# EAGLE schematic TinyNES_Main_Board (EAGLE 9.6.2)
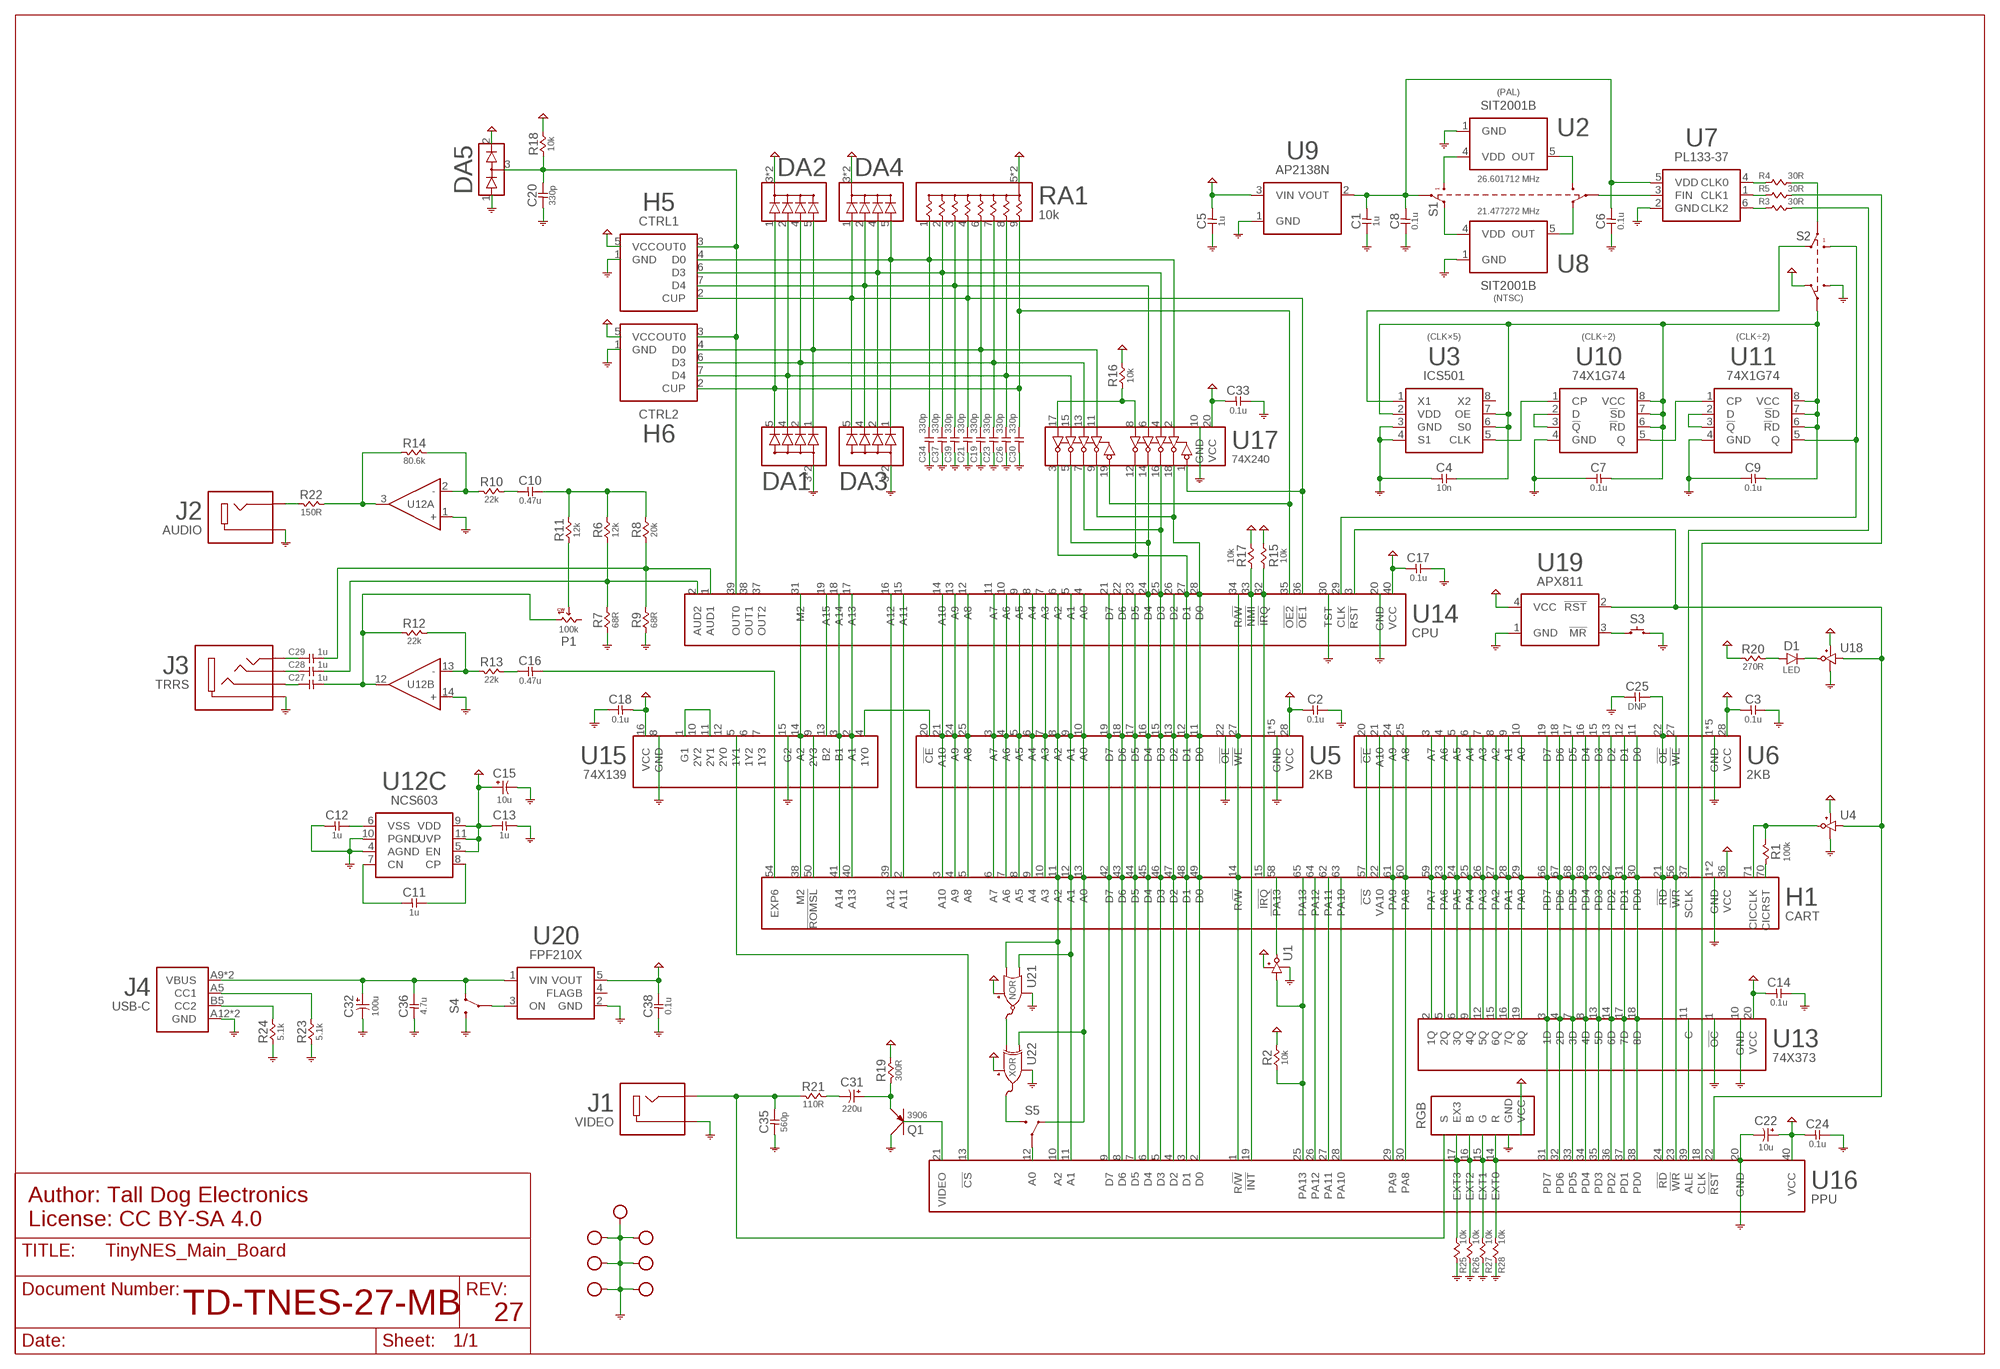
[diagram p0: schematic, sheet 1]

## Parts
C1  1u  CAP-NP-0805  [0805-NP]
C2  0.1u  CAP-NP-0805  [0805-NP]
C3  0.1u  CAP-NP-0805  [0805-NP]
C4  10n  CAP-NP-0805  [0805-NP]
C5  1u  CAP-NP-0805  [0805-NP]
C6  0.1u  CAP-NP-0805  [0805-NP]
C7  0.1u  CAP-NP-0805  [0805-NP]
C8  0.1u  CAP-NP-0805  [0805-NP]
C9  0.1u  CAP-NP-0805  [0805-NP]
C10  0.47u  CAP-NP-1206  [1206-NP]
C11  1u  CAP-NP-0805  [0805-NP]
C12  1u  CAP-NP-0805  [0805-NP]
C13  1u  CAP-NP-0805  [0805-NP]
C14  0.1u  CAP-NP-0805  [0805-NP]
C15  10u  CAP-P-B  [ECAP-B]
C16  0.47u  CAP-NP-1206  [1206-NP]
C17  0.1u  CAP-NP-0805  [0805-NP]
C18  0.1u  CAP-NP-0805  [0805-NP]
C19  330p  CAP-NP-0805  [0805-NP]
C20  330p  CAP-NP-0805  [0805-NP]
C21  330p  CAP-NP-0805  [0805-NP]
C22  10u  CAP-P-1206  [1206-P]
C23  330p  CAP-NP-0805  [0805-NP]
C24  0.1u  CAP-NP-0805  [0805-NP]
C25  DNP  CAP-NP-0805  [0805-NP]
C26  330p  CAP-NP-0805  [0805-NP]
C27  1u  CAP-NP-1210  [1210-NP]
C28  1u  CAP-NP-1210  [1210-NP]
C29  1u  CAP-NP-1210  [1210-NP]
C30  330p  CAP-NP-0805  [0805-NP]
C31  220u  CAP-P-E  [ECAP-E]
C32  100u  CAP-P-D  [ECAP-D]
C33  0.1u  CAP-NP-0805  [0805-NP]
C34  330p  CAP-NP-0805  [0805-NP]
C35  560p  CAP-NP-0805  [0805-NP]
C36  4.7u  CAP-NP-0805  [0805-NP]
C37  330p  CAP-NP-0805  [0805-NP]
C38  0.1u  CAP-NP-0805  [0805-NP]
C39  330p  CAP-NP-0805  [0805-NP]
D1  LED  DIODE-LED-5MM  [LED-5MM]
DA1  DA4-CA-SOT-363  [SOT-363-NP]
DA2  DA4-CK-SOT-363  [SOT-363-NP]
DA3  DA4-CA-SOT-363  [SOT-363-NP]
DA4  DA4-CK-SOT-363  [SOT-363-NP]
DA5  DA2-S  [SOT-23-3]
H1  CART  CART-72-CONN-VERT  [CART-72-2.50-CONN-VERT]
H5  CTRL1  CTRL  [JST-PH-7]
H6  CTRL2  CTRL  [JST-PH-7]
HOLE1  HOLE-M2.5  [HOLE-M2.5]
HOLE2  HOLE-M2.5  [HOLE-M2.5]
HOLE3  HOLE-M2.5  [HOLE-M2.5]
HOLE4  HOLE-M2.5  [HOLE-M2.5]
HOLE5  HOLE-M2.5  [HOLE-M2.5]
HOLE6  HOLE-M2.5  [HOLE-M2.5]
HOLE7  HOLE-M2.5  [HOLE-M2.5]
J1  VIDEO  JACK  [RCJ]
J2  AUDIO  JACK  [RCJ]
J3  TRRS  TRRS-SJ-43514  [SJ-43514]
J4  USB-C  USB-C-POWER  [USB4125]
P1  100k  POT  [POT-3361]
Q1  3906  PNP  [SOT-23-3]
R1  100k  RESISTOR-0805  [0805-NP]
R2  10k  RESISTOR-0805  [0805-NP]
R3  30R  RESISTOR-0805  [0805-NP]
R4  30R  RESISTOR-0805  [0805-NP]
R5  30R  RESISTOR-0805  [0805-NP]
R6  12k  RESISTOR-0805  [0805-NP]
R7  68R  RESISTOR-0805  [0805-NP]
R8  20k  RESISTOR-0805  [0805-NP]
R9  68R  RESISTOR-0805  [0805-NP]
R10  22k  RESISTOR-0805  [0805-NP]
R11  12k  RESISTOR-0805  [0805-NP]
R12  22k  RESISTOR-0805  [0805-NP]
R13  22k  RESISTOR-0805  [0805-NP]
R14  80.6k  RESISTOR-0805  [0805-NP]
R15  10k  RESISTOR-0805  [0805-NP]
R16  10k  RESISTOR-0805  [0805-NP]
R17  10k  RESISTOR-0805  [0805-NP]
R18  10k  RESISTOR-0805  [0805-NP]
R19  300R  RESISTOR-0805  [0805-NP]
R20  270R  RESISTOR-0805  [0805-NP]
R21  110R  RESISTOR-0805  [0805-NP]
R22  150R  RESISTOR-0805  [0805-NP]
R23  5.1k  RESISTOR-0805  [0805-NP]
R24  5.1k  RESISTOR-0805  [0805-NP]
R25  10k  RESISTOR-0603  [0603-NP]
R26  10k  RESISTOR-0603  [0603-NP]
R27  10k  RESISTOR-0603  [0603-NP]
R28  10k  RESISTOR-0603  [0603-NP]
RA1  10k  RA8  [EXBA10P]
RGB  RGB-TOP  [RGB-TOP]
S1  DPDT-LONG  [JS202011J]
S2  DPDT  [JS202011J]
S3  SWITCH  [TL1105]
S4  SPDT-EG1213  [EG1213]
S5  SPDT-CUS-12TB  [CUS-12TB]
U1  BUFFER  [SOT-23-5]
U2  SIT2001B  [SOT-23-5]
U3  ICS501  [SOIC-8]
U4  BUFFER  [SOT-23-5]
U5  2KB  [SOIC-28]
U6  2KB  [SOIC-28]
U7  PL133-37  [SOT-23-6]
U8  SIT2001B  [SOT-23-5]
U9  AP2138N  [SOT-23-3]
U10  74X1G74  [TSSOP-8]
U11  74X1G74  [TSSOP-8]
U12  NCS603  [TSSOP-14]
U13  74X373  [SOIC-20]
U14  CPU  [DIP-40]
U15  74X139  [SOIC-16]
U16  PPU  [DIP-40]
U17  74X240  [SOIC-20]
U18  BUFFER  [SOT-23-5]
U19  APX811  [SOT-143]
U20  FPF210X  [SOT-23-5]
U21  NOR  [SOT-23-5]
U22  XOR  [SOT-23-5]

## Nets
1Y0-!CS: U5.20(!CE) U15.4(1Y0)
3V3: C1.1 C6.1 C8.1 S1.BCOM U7.5(VDD) U9.2(VOUT)
!IRQ: H1.15(!IRQ) R15.1 U14.32(!IRQ)
!NMI: R17.1 U14.33(!NMI) U16.19(!INT)
!OE1: C21.2 DA3.5 DA4.1 H5.2(CUP) RA1.4 U14.36(!OE1) U17.1(1!OE)
!OE2: C30.2 DA1.5 DA2.1 H6.2(CUP) RA1.9 U14.35(!OE2) U17.19(2!OE)
!PA13: H1.58(!PA13) U1.4(Y)
!ROMSEL: H1.50(!ROMSL) U15.9(2Y3)
A0: H1.13(A0) S5.1 U5.10(A0) U14.4(A0) U22.1(B)
A0-NOR: U21.4(Y) U22.2(A)
A0-PPU: S5.2 U16.12(A0)
A0-XOR: S5.3 U22.4(Y)
A1: H1.12(A1) U5.9(A1) U14.5(A1) U16.11(A1) U21.1(B)
A2: H1.11(A2) U5.8(A2) U14.6(A2) U16.10(A2) U21.2(A)
A3: H1.10(A3) U5.7(A3) U14.7(A3)
A4: H1.9(A4) U5.6(A4) U14.8(A4)
A5: H1.8(A5) U5.5(A5) U14.9(A5)
A6: H1.7(A6) U5.4(A6) U14.10(A6)
A7: H1.6(A7) U5.3(A7) U14.11(A7)
A8: H1.5(A8) U5.25(A8) U14.12(A8)
A9: H1.4(A9) U5.24(A9) U14.13(A9)
A10: H1.3(A10) U5.21(A10) U14.14(A10)
A11: H1.2(A11) U14.15(A11)
A12: H1.39(A12) U14.16(A12)
A13: H1.40(A13) U14.17(A13) U15.2(A1)
A14: H1.41(A14) U14.18(A14) U15.3(B1)
A15: U14.19(A15) U15.13(B2)
ALE: U13.11(C) U16.39(ALE)
AUDIO1-AC: C29.2 J3.2(T)
AUDIO1-DC: C29.1 R8.1 R9.2 U14.1(AUD1)
AUDIO2-AC: C28.2 J3.3(RT)
AUDIO2-DC: C28.1 R6.1 R7.2 U14.2(AUD2)
AUDIO-MIX: C10.2 R6.2 R8.2 R11.2
AUDIO-MIX-1: C10.1 R10.1
AUDIO-MIX-2: R10.2 R14.1 U12.2(A:-)
AUDIO-MIX-AC: J2.2B(T) J2.2T(T) R22.2
AUDIO-MIX-DC: R14.2 R22.1 U12.3(A:OUT)
CARTCLK: H1.37(SCLK) R3.1
CC1: J4.A5(CC1) R23.2
CC2: J4.B5(CC2) R24.2
CIC: H1.71(CICCLK) R1.2 U4.4(Y)
CICRST: H1.70(CICRST) R1.1
CLK0: R4.2 U7.4(CLK0)
CLK1: R5.2 U7.1(CLK1)
CLK2: R3.2 U7.6(CLK2)
CLK5X: U3.5(CLK) U10.1(CP)
CLK5X/2: U10.5(Q) U11.1(CP)
CLK-FIN: S1.ACOM U7.3(FIN)
CLK-NTSC: S1.AB U8.5(OUT)
CLK-PAL: S1.AA U2.5(OUT)
CLKIN: S2.BB U3.1(X1)
CLKVCC: C4.2 C7.1 C9.1 S2.ACOM U3.2(VDD) U3.6(S0) U3.7(OE) U10.6(!R!D) U10.7(!S!D) U10.8(VCC) U11.6(!R!D) U11.7(!S!D) U11.8(VCC)
CN: C11.1 U12.7(C:CN)
CP: C11.2 U12.8(C:CP)
CPUCLK: S2.BA U11.5(Q) U14.29(CLK)
CPUCLK-SW: R4.1 S2.BCOM
D0: H1.49(D0) U5.11(D0) U14.28(D0) U16.2(D0) U17.9(2Y1) U17.18(1Y1)
D1: H1.48(D1) U5.12(D1) U14.27(D1) U16.3(D1) U17.3(2Y4) U17.12(1Y4)
D1-PULLUP: R16.1 U17.8(1A4) U17.17(2A4)
D2: H1.47(D2) U5.13(D2) U14.26(D2) U16.4(D2)
D3: H1.46(D3) U5.15(D3) U14.25(D3) U16.5(D3) U17.7(2Y2) U17.16(1Y2)
D4: H1.45(D4) U5.16(D4) U14.24(D4) U16.6(D4) U17.5(2Y3) U17.14(1Y3)
D5: H1.44(D5) U5.17(D5) U14.23(D5) U16.7(D5)
D6: H1.43(D6) U5.18(D6) U14.22(D6) U16.8(D6)
D7: H1.42(D7) U5.19(D7) U14.21(D7) U16.9(D7)
DQ1: U10.2(D) U10.3(!Q)
DQ2: U11.2(D) U11.3(!Q)
EXP6: C16.1 H1.54(EXP6)
EXP6-1: C16.2 R13.1
EXP6-2: R12.1 R13.2 U12.13(B:-)
EXP6-AC: C27.2 J3.4(RS)
EXP6-DC: C27.1 P1.3(CW) R12.2 U12.12(B:OUT)
EXP6-MIX: P1.2(WIPER) R11.1
EXT3: R25.2 RGB.EXT3(EX3) U16.17(EXT3)
G1-2Y1: U15.1(G1) U15.11(2Y1)
GND: C1.2 C2.2 C3.2 C4.1 C5.2 C6.2 C7.2 C8.2 C9.2 C12.1 C13.1 C14.2 C15.C C17.2 C18.2 C19.1 C20.1 C21.1 C22.N(C) C23.1 C24.2 C25.1 C26.1 C30.1 C32.C C33.2 C34.1 C35.1 C36.1 C37.1 C38.1 C39.1 DA1.3(COM) DA1.6(COM) DA3.3(COM) DA3.6(COM) DA5.1(A) H1.1(GND) H1.72(GND) H5.1(GND) H6.1(GND) HOLE1.P$1 HOLE1.P$6 HOLE1.P$7 HOLE1.P$8 HOLE1.P$9 HOLE1.P$13 HOLE1.P$14 HOLE1.P$15 HOLE1.P$16 HOLE2.P$1 HOLE2.P$6 HOLE2.P$7 HOLE2.P$8 HOLE2.P$9 HOLE2.P$13 HOLE2.P$14 HOLE2.P$15 HOLE2.P$16 HOLE3.P$1 HOLE3.P$6 HOLE3.P$7 HOLE3.P$8 HOLE3.P$9 HOLE3.P$13 HOLE3.P$14 HOLE3.P$15 HOLE3.P$16 HOLE4.P$1 HOLE4.P$6 HOLE4.P$7 HOLE4.P$8 HOLE4.P$9 HOLE4.P$13 HOLE4.P$14 HOLE4.P$15 HOLE4.P$16 HOLE5.P$1 HOLE5.P$6 HOLE5.P$7 HOLE5.P$8 HOLE5.P$9 HOLE5.P$13 HOLE5.P$14 HOLE5.P$15 HOLE5.P$16 HOLE6.P$1 HOLE6.P$6 HOLE6.P$7 HOLE6.P$8 HOLE6.P$9 HOLE6.P$13 HOLE6.P$14 HOLE6.P$15 HOLE6.P$16 HOLE7.P$1 HOLE7.P$6 HOLE7.P$7 HOLE7.P$8 HOLE7.P$9 HOLE7.P$13 HOLE7.P$14 HOLE7.P$15 HOLE7.P$16 J1.1B(S) J1.1T(S) J2.1B(S) J2.1T(S) J3.1(S) J4.A12(GND) J4.B12(GND) Q1.3(C) R7.1 R9.1 R23.1 R24.1 R25.1 R26.1 R27.1 R28.1 RGB.GND S2.AA S3.2 S4.3 U1.1(GND) U1.3(GND) U2.1(GND) U3.3(GND) U3.4(S1) U4.1(GND) U4.3(GND) U5.1(GND) U5.2(GND) U5.14(GND) U5.22(!OE) U5.23(GND) U5.26(GND) U6.1(GND) U6.2(GND) U6.14(GND) U6.23(GND) U6.26(GND) U7.2(GND) U8.1(GND) U9.1(GND) U10.4(GND) U11.4(GND) U12.1(A:+) U12.4(C:AGND) U12.10(C:PGND) U12.14(B:+) U13.1(!OC) U13.10(GND) U14.20(GND) U14.30(TST) U15.8(GND) U15.15(G2) U16.20(GND) U17.10(GND) U18.1(GND) U18.3(GND) U19.1(GND) U20.2(GND) U21.3(GND) U22.3(GND)
GND-CAP: C12.2 U12.6(C:VSS)
LEDA: D1.A R20.1
LEDK: D1.K(C) U18.4(Y)
M2: H1.38(M2) U14.31(M2) U15.14(A2)
OUT0: C20.2 DA5.3(COM) H5.3(OUT0) H6.3(OUT0) R18.1 U14.39(OUT0)
P1-D0: C34.2 DA3.1 DA4.5 H5.4(D0) RA1.1 U17.2(1A1)
P1-D3: C37.2 DA3.2 DA4.4 H5.6(D3) RA1.2 U17.4(1A2)
P1-D4: C39.2 DA3.4 DA4.2 H5.7(D4) RA1.3 U17.6(1A3)
P2-D0: C19.2 DA1.1 DA2.5 H6.4(D0) RA1.6 U17.11(2A1)
P2-D3: C23.2 DA1.2 DA2.4 H6.6(D3) RA1.7 U17.13(2A2)
P2-D4: C26.2 DA1.4 DA2.2 H6.7(D4) RA1.8 U17.15(2A3)
PA0: H1.29(PA0) U6.10(A0) U13.19(8Q)
PA1: H1.28(PA1) U6.9(A1) U13.16(7Q)
PA2: H1.27(PA2) U6.8(A2) U13.15(6Q)
PA3: H1.26(PA3) U6.7(A3) U13.12(5Q)
PA4: H1.25(PA4) U6.6(A4) U13.9(4Q)
PA5: H1.24(PA5) U6.5(A5) U13.6(3Q)
PA6: H1.23(PA6) U6.4(A6) U13.5(2Q)
PA7: H1.59(PA7) U6.3(A7) U13.2(1Q)
PA8: H1.60(PA8) U6.25(A8) U16.30(PA8)
PA9: H1.61(PA9) U6.24(A9) U16.29(PA9)
PA10: H1.63(PA10) U16.28(PA10)
PA11: H1.62(PA11) U16.27(PA11)
PA12: H1.64(PA12) U16.26(PA12)
PA13: H1.65(PA13) R2.1 U1.2(A) U16.25(PA13)
PD0: H1.30(PD0) U6.11(D0) U13.18(8D) U16.38(PD0)
PD1: H1.31(PD1) U6.12(D1) U13.17(7D) U16.37(PD1)
PD2: H1.32(PD2) U6.13(D2) U13.14(6D) U16.36(PD2)
PD3: H1.33(PD3) U6.15(D3) U13.13(5D) U16.35(PD3)
PD4: H1.69(PD4) U6.16(D4) U13.8(4D) U16.34(PD4)
PD5: H1.68(PD5) U6.17(D5) U13.7(3D) U16.33(PD5)
PD6: H1.67(PD6) U6.18(D6) U13.4(2D) U16.32(PD6)
PD7: H1.66(PD7) U6.19(D7) U13.3(1D) U16.31(PD7)
PPU-!CS: U15.5(1Y1) U16.13(!CS)
PPU-!RD: C25.2 H1.21(!RD) U6.22(!OE) U16.24(!RD)
PPU-!WR: H1.56(!WR) U6.27(!WE) U16.23(!WR)
PPUCLK: R5.1 U16.18(CLK)
PWR-ON: S4.2 U20.3(ON)
R/!W: H1.14(R/!W) U5.27(!WE) U14.34(R/!W) U16.1(R/!W)
RESET: U4.2(A) U14.3(!RST) U16.22(!RST) U18.2(A) U19.2(!RST)
RESET-SW: S3.1 U19.3(!MR)
RGB-BLUE: R26.2 RGB.B U16.16(EXT2)
RGB-GREEN: R27.2 RGB.G U16.15(EXT1)
RGB-RED: R28.2 RGB.R U16.14(EXT0)
VCC: C2.1 C3.1 C5.1 C13.2 C14.1 C15.A C17.1 C18.1 C22.P(A) C24.1 C33.1 C38.2 DA2.3(COM) DA2.6(COM) DA4.3(COM) DA4.6(COM) DA5.2(K) H1.36(VCC) H5.5(VCC) H6.5(VCC) R2.2 R15.2 R16.2 R17.2 R18.2 R19.1 R20.2 RA1.5(COM) RA1.10(COM) RGB.VCC@1(VCC) RGB.VCC@2(VCC) RGB.VCC@3(VCC) S2.AB U1.5(VCC) U4.5(VCC) U5.28(VCC) U6.28(VCC) U9.3(VIN) U12.5(C:EN) U12.9(C:VDD) U12.11(C:UVP) U13.20(VCC) U14.40(VCC) U15.16(VCC) U16.40(VCC) U17.20(VCC) U18.5(VCC) U19.4(VCC) U20.5(VOUT) U21.5(VCC) U22.5(VCC)
VDD-NTSC: S1.BB U8.4(VDD)
VDD-PAL: S1.BA U2.4(VDD)
VIDEO: Q1.1(B) U16.21(VIDEO)
VIDEO1: C31.A Q1.2(E) R19.2
VIDEO2: C31.C R21.1
VIDEO-OUT: C35.2 J1.2B(T) J1.2T(T) R21.2 RGB.S
VIN: C32.A C36.2 J4.A9(VBUS) J4.B9(VBUS) S4.1 U20.1(VIN)
VRAM-!CS: H1.57(!CS) U6.20(!CE)
VRAM-A10: H1.22(VA10) U6.21(A10)
Unconnected: P1.1(CCW) U3.8(X2) U14.37(OUT2) U14.38(OUT1) U15.6(1Y2) U15.7(1Y3) U15.10(2Y2) U15.12(2Y0) U20.4(FLAGB)

## Notes on the sheet
- (PAL)
- 26.601712 MHz
- 21.477272 MHz
- (NTSC)
- (CLK×5) | (CLK÷2) | (CLK÷2)
- Author: Tall Dog Electronics
  License: CC BY-SA 4.0
- TD-TNES-27-MB
- 27

## Library data of the parts
C1-C14 C16-C21 C23-C30 C33-C39 = TinyNES_Library:CAP-NP
C15 C22 C31 C32 = TinyNES_Library:CAP-P
D1 = TinyNES_Library:DIODE
DA1 DA3 = TinyNES_Library:DA4-CA
DA2 DA4 = TinyNES_Library:DA4-CK
DA5 = TinyNES_Library:DA2-S
H1 = TinyNES_Library:CART-72
H5 H6 = TinyNES_Library:CTRL
HOLE1-HOLE7 = TinyNES_Library:HOLE
J1 J2 = TinyNES_Library:JACK
J3 = TinyNES_Library:TRRS
J4 = TinyNES_Library:USB-C-POWER
P1 = TinyNES_Library:POT
Q1 = TinyNES_Library:PNP
R1-R28 = TinyNES_Library:RESISTOR
RA1 = TinyNES_Library:RA8
RGB = TinyNES_Library:RGB
S1 = TinyNES_Library:DPDT-LONG
S2 = TinyNES_Library:DPDT
S3 = TinyNES_Library:SWITCH
S4 S5 = TinyNES_Library:SPDT
U1 U4 U18 = TinyNES_Library:BUFFER
U2 U8 = TinyNES_Library:SIT2001B
U3 = TinyNES_Library:ICS501
U5 U6 = TinyNES_Library:2KB
U7 = TinyNES_Library:PL133-37
U9 = TinyNES_Library:AP2138N
U10 U11 = TinyNES_Library:74X1G74
U12 = TinyNES_Library:NCS603
U13 = TinyNES_Library:74X373
U14 = TinyNES_Library:CPU
U15 = TinyNES_Library:74X139
U16 = TinyNES_Library:PPU
U17 = TinyNES_Library:74X240
U19 = TinyNES_Library:APX811
U20 = TinyNES_Library:FPF210X
U21 = TinyNES_Library:NOR
U22 = TinyNES_Library:XOR